# Altium schematic sheet USB.SchDoc
size A4
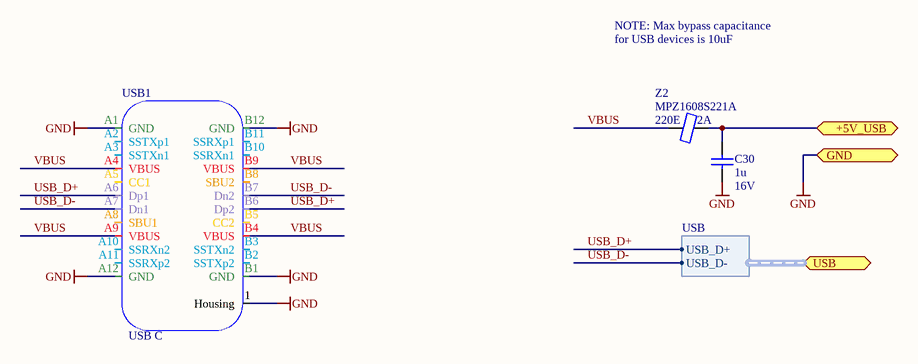
[diagram p0: USB.SchDoc]

## Parts
C30  value 1u  Value2: 16V  [SMD_CAP_0603]  (hidden comment: C_SMD_CER_1U_16V_10%_X7R_0603)
USB1  Type: USB C  [SMD_CON_USB_TYPEC_VERTICAL_10132328-10011LF]  (hidden comment: *)
Z2  value 220E  Type: MPZ1608S221A  Value2: 2A  [SMD_RES_0603]  (hidden comment: Z_SMD_FERRITE_2A_220E@100MHZ_0603)

## Ports
+5V_USB, GND, USB (harness USB)

## Harnesses
USB: USB_D-, USB_D+

## Nets
GND: C30.1 USB1.1(Housing) USB1.A1(GND) USB1.A12(GND) USB1.B1(GND) USB1.B12(GND) ; port GND
+5V_USB: C30.2 Z2.2 ; port +5V_USB
USB_D+: USB1.A6(Dp1) USB1.B6(Dp2) ; port USB.USB_D+
USB_D-: USB1.A7(Dn1) USB1.B7(Dn2) ; port USB.USB_D-
VBUS: USB1.A4(VBUS) USB1.A9(VBUS) USB1.B4(VBUS) USB1.B9(VBUS) Z2.1

Not connected (* = marked no-connect by the designer): USB1 A2(SSTXp1) A3(SSTXn1) A5(CC1) A8(SBU1) A10(SSRXn2) A11(SSRXp2) B2(SSTXp2) B3(SSTXn2) B5(CC2) B8(SBU2) B10(SSRXn1) B11(SSRXp1)

## Notes on the sheet
- NOTE: Max bypass capacitance
- for USB devices is 10uF
- Title
- Size:
- Date:
- A4
- Number:
- Time:
- Revision:
- Sheet
- of
- File:

## Library data of the parts
C30 = C_SMD_CER_1U_16V_10%_X7R_0603: 1µF ±10% 16V Ceramic Capacitor X7R 0603 (1608 Metric); Supplier - Digikey: 1276-1019-1-ND
USB1 = X_CONNECTOR_USB_TYPEC_VERTICAL: USB - C (Type - C) USB 3.1 (USB 3.1 Gen 2, Superspeed+) Receptacle Connector 24 Position Surface Mount, Through Hole; Supplier - Digikey: 609-5380-1-ND
Z2 = Z_SMD_FERRITE_2A_220E@100MHZ_0603: Ferrite Beads; Supplier - E+H Flowtec AG: 50104604; Supplier - Digikey: 445-1565-1-ND